# EAGLE schematic lights_node (EAGLE 6.5.0)
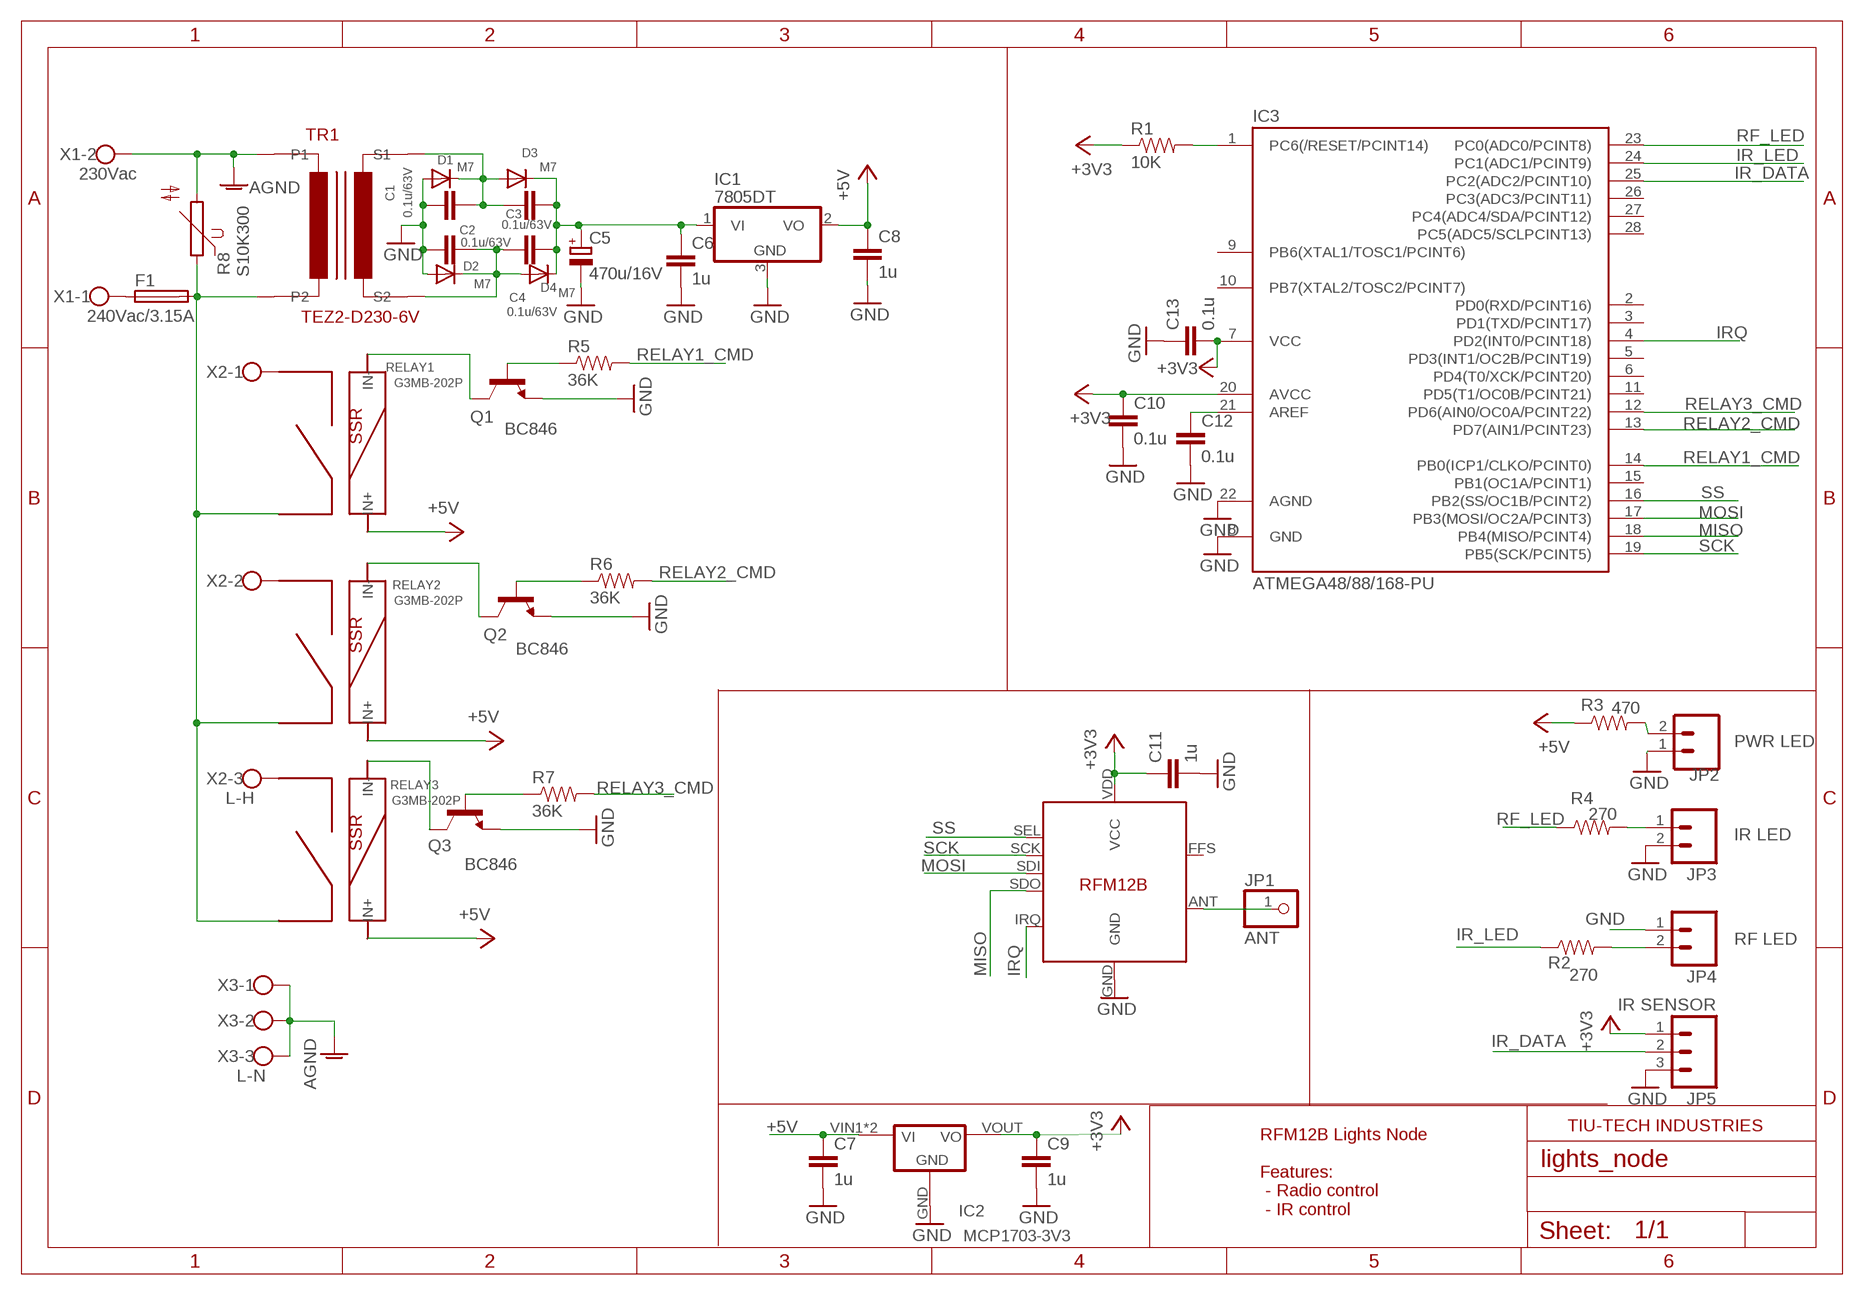
[diagram p0: schematic, sheet 1]

## Parts
C1  0.1u/63V  CAP0805  [0805]
C2  0.1u/63V  CAP0805  [0805]
C3  0.1u/63V  CAP0805  [0805]
C4  0.1u/63V  CAP0805  [0805]
C5  470u/16V  CPOL-EUE2.5-7  [E2,5-7]
C6  1u  CAP0805  [0805]
C7  1u  CAP0805  [0805]
C8  1u  CAP0805  [0805]
C9  1u  CAP0805  [0805]
C10  0.1u  CAP0805  [0805]
C11  1u  CAP0805  [0805]
C12  0.1u  CAP0805  [0805]
C13  0.1u  CAP0805  [0805]
D1  M7  DIODE-DO-214AC  [DO-214AC]
D2  M7  DIODE-DO-214AC  [DO-214AC]
D3  M7  DIODE-DO-214AC  [DO-214AC]
D4  M7  DIODE-DO-214AC  [DO-214AC]
F1  240Vac/3.15A  PICOFUSE  [PICOFUSE]
IC1  7805DT  [TO252]
IC2  MCP1703-3V3  MCP1703-SOT89  [MCP1703-SOT89]
IC3  ATMEGA48/88/168-PU  [DIL28-3]
JP1  ANT  PINHD-1X1  [1X01]
JP2  M02PTH  [1X02]
JP3  M02PTH  [1X02]
JP4  M02PTH  [1X02]
JP5  IR SENSOR  M03PTH  [1X03]
Q1  BC846  BC847C-NPN-SOT23-BEC  [SOT23-BEC]
Q2  BC846  BC847C-NPN-SOT23-BEC  [SOT23-BEC]
Q3  BC846  BC847C-NPN-SOT23-BEC  [SOT23-BEC]
R1  10K  RESISTOR0805-RES  [0805]
R2  270  RESISTOR0805-RES  [0805]
R3  470  RESISTOR0805-RES  [0805]
R4  270  RESISTOR0805-RES  [0805]
R5  36K  RESISTOR0805-RES  [0805]
R6  36K  RESISTOR0805-RES  [0805]
R7  36K  RESISTOR0805-RES  [0805]
R8  S10K300  [S10K300]
RELAY1  G3MB-202P  [G3MB-202P]
RELAY2  G3MB-202P  [G3MB-202P]
RELAY3  G3MB-202P  [G3MB-202P]
RFM1  RFM12B  [RFM12B]
TR1  TEZ2-D230-6V  TEZ1.5-D230-6V  [TEZ1.5-PKG]
X1  230Vac  W237-102  [W237-102]
X2  L-H  W237-103  [W237-103]
X3  L-N  W237-103  [W237-103]

## Nets
+3V3: C9.1 C10.1 C11.1 C13.2 IC2.VOUT(VO) IC3.7(VCC) IC3.20(AVCC) JP5.1 R1.1 RFM1.VDD(VCC)
+5V: C7.1 C8.1 IC1.2(VO) IC2.VIN1(VI) IC2.VIN2(VI) R3.1 RELAY1.IN+ RELAY2.IN+ RELAY3.IN+
AGND: R8.2 TR1.P1 X1.2 X3.1 X3.2 X3.3
GND: C1.1 C2.1 C5.- C6.2 C7.2 C8.2 C9.2 C10.2 C11.2 C12.2 C13.1 D1.A D2.A IC1.3(GND) IC2.GND IC3.8(GND) IC3.22(AGND) JP2.1 JP3.2 JP4.1 JP5.3 Q1.E Q2.E Q3.E RFM1.GND
IR_DATA: IC3.25(PC2(ADC2/PCINT10)) JP5.2
IR_LED: IC3.24(PC1(ADC1/PCINT9)) R2.1
IRQ: IC3.4(PD2(INT0/PCINT18)) RFM1.IRQ
MISO: IC3.18(PB4(MISO/PCINT4)) RFM1.SDO
MOSI: IC3.17(PB3(MOSI/OC2A/PCINT3)) RFM1.SDI
N$1: F1.2 R8.1 RELAY1.K1 RELAY2.K1 RELAY3.K1 TR1.P5(P2)
N$2: RELAY1.K2 X2.1
N$3: RELAY2.K2 X2.2
N$4: RELAY3.K2 X2.3
N$5: Q1.C RELAY1.IN-
N$6: Q1.B R5.1
N$7: Q2.C RELAY2.IN-
N$8: JP2.2 R3.2
N$9: JP4.2 R2.2
N$10: C1.2 C3.1 D1.C D3.A TR1.S7(S1)
N$11: C2.2 C4.1 D2.C D4.A TR1.S9(S2)
N$12: JP3.1 R4.2
N$13: Q2.B R6.1
N$14: Q3.B R7.1
N$15: C12.1 IC3.21(AREF)
N$16: JP1.1 RFM1.ANT
N$17: Q3.C RELAY3.IN-
N$18: F1.1 X1.1
RELAY1_CMD: IC3.14(PB0(ICP1/CLKO/PCINT0)) R5.2
RELAY2_CMD: IC3.13(PD7(AIN1/PCINT23)) R6.2
RELAY3_CMD: IC3.12(PD6(AIN0/OC0A/PCINT22)) R7.2
RESET: IC3.1(PC6(/RESET/PCINT14)) R1.2
RF_LED: IC3.23(PC0(ADC0/PCINT8)) R4.1
SCK: IC3.19(PB5(SCK/PCINT5)) RFM1.SCK
SS: IC3.16(PB2(SS/OC1B/PCINT2)) RFM1.SEL
VRAW: C3.2 C4.2 C5.+ C6.1 D3.C D4.C IC1.1(VI)
Unconnected: IC3.2(PD0(RXD/PCINT16)) IC3.3(PD1(TXD/PCINT17)) IC3.5(PD3(INT1/OC2B/PCINT19)) IC3.6(PD4(T0/XCK/PCINT20)) IC3.9(PB6(XTAL1/TOSC1/PCINT6)) IC3.10(PB7(XTAL2/TOSC2/PCINT7)) IC3.11(PD5(T1/OC0B/PCINT21)) IC3.15(PB1(OC1A/PCINT1)) IC3.26(PC3(ADC3/PCINT11)) IC3.27(PC4(ADC4/SDA/PCINT12)) IC3.28(PC5(ADC5/SCLPCINT13)) RFM1.FFS

## Notes on the sheet
- PWR LED
- IR LED
- RF LED
- TIU-TECH INDUSTRIES
- RFM12B Lights Node
  
  Features:
   - Radio control
   - IR control

## Library data of the parts
C1-C4 C6-C13 = SparkFun-Passives:CAP: Capacitor Standard 0603 ceramic capacitor, and 0.1" leaded capacitor.
C5 = resistor:CPOL-EU: POLARIZED CAPACITOR, European symbol
D1-D4 = diode:DIODE-: DIODE
F1 = fuse:PICOFUSE: PICOFUSE 19275, Wickmann; OC_FARNELL: unknown; OC_NEWARK: unknown
IC1 = linear:78*: Positive VOLTAGE REGULATOR Source: http://cache.national.com/ds/LM/LM78L05.pdf http://www.fairchildsemi.com/ds/LM/LM7805.pdf
IC2 = MCP1703_SOT89:MCP1703-SOT89
IC3 = atmega48_88_168:ATMEGA48/88/168-PU
JP1 = pinhead:PINHD-1X1: PIN HEADER
JP2-JP4 = SparkFun-Connectors:M02: Standard 2-pin 0.1" header. Use with - straight break away headers ( PRT-00116) - right angle break away headers (PRT-00553) - swiss pins (PRT-00743) - machine pins (PRT-00117) - female headers (PRT-00115) Molex polarized connector foot print use with: PRT-08233 with associated crimp pins and housings. 2.54_SCREWTERM for use with PRT-10571. 3.5mm Screw Terminal footprints for PRT-08084 5mm Screw Terminal footprints for use with PRT-08433
JP5 = SparkFun-Connectors:M03: Header 3 Standard 3-pin 0.1" header. Use with straight break away headers (SKU : PRT-00116), right angle break away headers (PRT-00553), swiss pins (PRT-00743), machine pins (PRT-00117), and female headers (PRT-00115). Molex polarized connector foot print use with SKU : PRT-08232 with associated crimp pins and housings.
Q1-Q3 = transistor:*-NPN-: NPN Transistror BF959 corrected 2008.03.06
R1-R4 = SparkFun-Passives:RESISTOR: Resistor Basic schematic elements and footprints for 0603, 1206, and PTH resistors.
R5-R7 = SparkFun-Resistors:RESISTOR: Resistor Basic schematic elements and footprints for 0603, 1206, and PTH resistors.
R8 = varistor:S10K300: VARISTOR
RELAY1-RELAY3 = g3mb:G3MB-202P
RFM1 = JeeParts:RFM12B
TR1 = breve-tufvassons-transf:TEZ1.5-D230-6V: Breve Tufvassons PCB Transformer(1.5VA, 230Vac, 6Vac)
X1 = con-wago-500:W237-102: WAGO SCREW CLAMP; MPN: 237-102; OC_FARNELL: unknown; OC_NEWARK: 70K9898
X2 X3 = con-wago-500:W237-103: WAGO SCREW CLAMP; MPN: 237-103; OC_FARNELL: unknown; OC_NEWARK: 18M7116